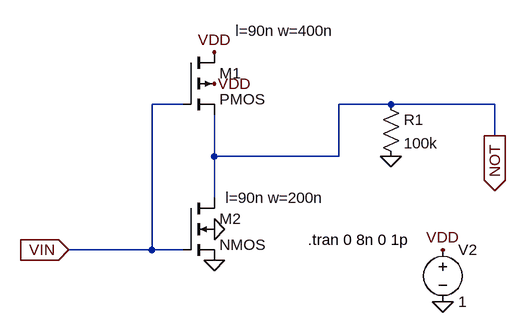
[diagram p0: schematic not.asc]
not.asc, the LTspice schematic file:
Version 4
SHEET 1 880 680
WIRE 96 -208 48 -208
WIRE 416 -208 336 -208
WIRE 576 -208 416 -208
WIRE 576 -160 576 -208
WIRE 144 -128 144 -192
WIRE 336 -128 336 -208
WIRE 336 -128 144 -128
WIRE 144 -64 144 -128
WIRE 48 16 48 -208
WIRE 48 16 -80 16
WIRE 96 16 48 16
FLAG 144 32 0
FLAG 144 -16 0
FLAG 496 96 0
FLAG 496 16 VDD
FLAG 144 -288 VDD
FLAG 144 -240 VDD
FLAG 576 -160 NOT
IOPIN 576 -160 Out
FLAG 416 -128 0
FLAG -80 16 VIN
IOPIN -80 16 In
SYMBOL pmos4 96 -288 R0
WINDOW 123 81 -33 Left 2
SYMATTR Value2 l=90n w=400n
SYMATTR InstName M1
SYMBOL nmos4 96 -64 R0
WINDOW 123 65 0 Left 2
SYMATTR Value2 l=90n w=200n
SYMATTR InstName M2
SYMBOL voltage 496 0 R0
WINDOW 123 0 0 Left 0
WINDOW 39 0 0 Left 0
SYMATTR InstName V2
SYMATTR Value 1
SYMBOL res 400 -224 R0
SYMATTR InstName R1
SYMATTR Value 100k
TEXT 288 0 Left 2 !.tran 0 8n 0 1p

The netlist it stands for:
* not.asc
M1 VDD VIN NOT VDD PMOS l=90n w=400n
M2 NOT VIN 0 0 NMOS l=90n w=200n
V2 VDD 0 1
R1 NOT 0 100k
.model NMOS NMOS
.model PMOS PMOS
.lib standard.mos
.tran 0 8n 0 1p
.backanno
.end

* Results of the author's LTspice run, read from the files saved beside the schematic
* Operating Point, zero values left out:
*   V(vdd) = 1 V
*   V(not) = 893.8 mV
*   Id(M2) = 1.798 pA
*   Id(M1) = 8.938 µA
*   Is(M1) = -8.938 µA
*   I(R1) = 8.938 µA
*   I(V2) = -8.938 µA